# EAGLE design Frequency Counter (EAGLE 9.1.2)
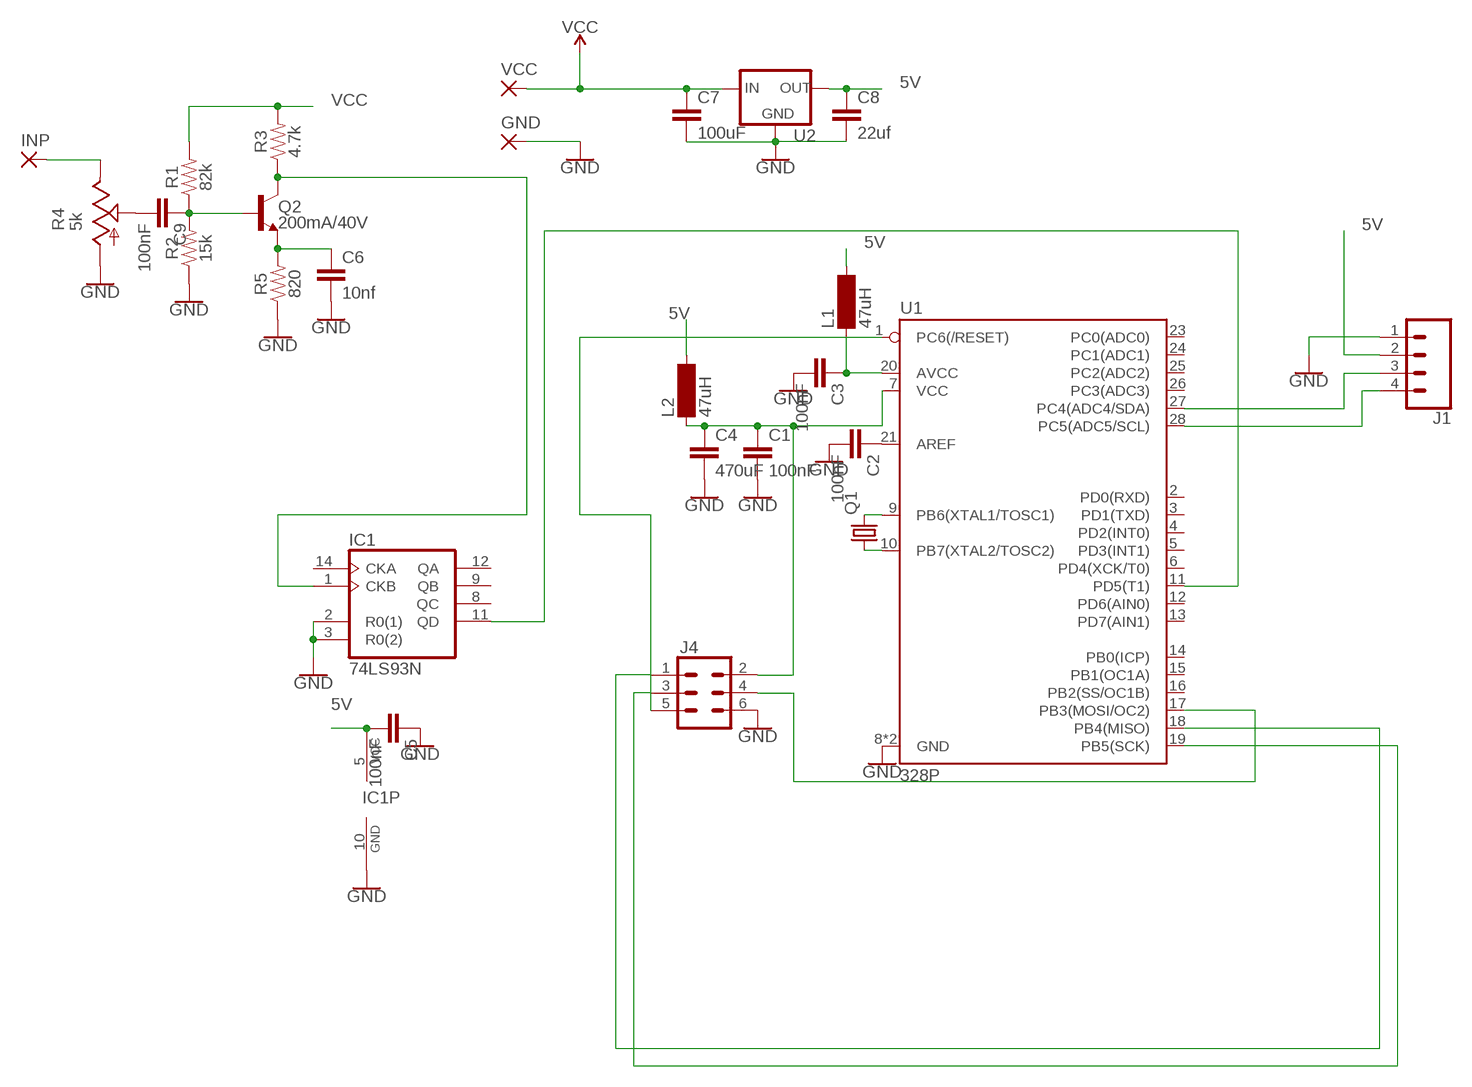
[diagram p0: schematic, sheet 1]

## Parts
C1  100nF  C5/3.5  [C5B3.5]
C2  100nF  C5/3.5  [C5B3.5]
C3  100nF  C5/3.5  [C5B3.5]
C4  470uF  C5/3.5  [C5B3.5]
C5  100nF  C5/3.5  [C5B3.5]
C6  10nf  C5/3.5  [C5B3.5]
C7  100uF  C5/3.5  [C5B3.5]
C8  22uf  C5/3.5  [C5B3.5]
C9  100nF  C5/3.5  [C5B3.5]
GND  3,17/1,1  [3,17/1,1]
IC1  74LS93N  [DIL14]
INP  2,54/1,1  [2,54/1,1]
J1  CONN_04  [1X04]
J4  CONN_03X2NO_SILK  [2X3-NS]
L1  47uH  BS75  [BS75]
L2  47uH  BS75  [BS75]
Q1  CRYTALHC49S  [HC49/S]
Q2  200mA/40V  TRANS_NPN-2N3904  [TO-92]
R1  82k  10KOHM-HORIZ-1/4W-1%  [AXIAL-0.3]
R2  15k  10KOHM-HORIZ-1/4W-1%  [AXIAL-0.3]
R3  4.7k  10KOHM-HORIZ-1/4W-1%  [AXIAL-0.3]
R4  5k  TRIM_US-B25V  [B25V]
R5  820  10KOHM-HORIZ-1/4W-1%  [AXIAL-0.3]
U1  328P  ATMEGA328P_PDIP  [DIP28]
U2  V_REG_78XXSINK  [TO220-IGO]
VCC  3,17/1,1  [3,17/1,1]

## Nets
5V: C5.2 C8.1 IC1.5(VCC) J1.2 L1.2 L2.2 U2.OUT
GND: C1.2 C2.2 C3.2 C4.2 C5.1 C6.2 C7.2 C8.2 GND.1(P) IC1.2(R0(1)) IC1.3(R0(2)) IC1.10(GND) J1.1 J4.6 R2.P$1 R4.A R5.P$1 U1.8(GND) U1.22(GND) U2.GND
N$1: C2.1 U1.21(AREF)
N$2: Q1.2 U1.9(PB6(XTAL1/TOSC1))
N$3: Q1.1 U1.10(PB7(XTAL2/TOSC2))
N$4: C1.1 C4.1 J4.2 L2.1 U1.7(VCC)
N$5: J1.3 U1.27(PC4(ADC4/SDA))
N$6: J1.4 U1.28(PC5(ADC5/SCL))
N$7: INP.1(P) R4.E
N$8: C9.1 Q2.2(B) R1.P$1 R2.P$2
N$9: C9.2 R4.S
N$11: IC1.1(CKB) Q2.3(C) R3.P$1
N$12: C6.1 Q2.1(E) R5.P$2
N$15: IC1.11(QD) U1.11(PD5(T1))
N$21: C3.1 L1.1 U1.20(AVCC)
N$22: J4.4 U1.17(PB3(MOSI/OC2))
N$23: J4.1 U1.18(PB4(MISO))
N$24: J4.3 U1.19(PB5(SCK))
N$25: J4.5 U1.1(PC6(/RESET))
VCC: C7.1 R1.P$2 R3.P$2 U2.IN VCC.1(P)
Unconnected: IC1.8(QC) IC1.9(QB) IC1.12(QA) IC1.14(CKA) U1.2(PD0(RXD)) U1.3(PD1(TXD)) U1.4(PD2(INT0)) U1.5(PD3(INT1)) U1.6(PD4(XCK/T0)) U1.12(PD6(AIN0)) U1.13(PD7(AIN1)) U1.14(PB0(ICP)) U1.15(PB1(OC1A)) U1.16(PB2(SS/OC1B)) U1.23(PC0(ADC0)) U1.24(PC1(ADC1)) U1.25(PC2(ADC2)) U1.26(PC3(ADC3))

## Library data of the parts
C1-C9 = capacitor-wima:C: CAPACITOR naming: grid - package width
GND VCC = wirepad:3,17/1,1: THROUGH-HOLE PAD
IC1 = 74xx-us:74*93: Decade, divide by twelve and binary COUNTER
INP = wirepad:2,54/1,1: THROUGH-HOLE PAD
J1 = SparkFun-Connectors:CONN_04: Multi connection point. Often used as Generic Header-pin footprint for 0.1 inch spaced/style header connections On any of the 0.1 inch spaced packages, you can populate with these: Break Away Headers - Straight <https://www.sparkfun.com/products/116> (PRT-00116) Break Away Male Headers - Right Angle <https://www.sparkfun.com/products/553> (PRT-00553) Female Headers <https://www.sparkfun.com/products/115> (PRT-00115) Break Away Headers - Machine Pin <https://www.sparkfun.com/products/117> (PRT-00117) Break Away Female Headers - Swiss Machine Pin <https://www.sparkfun.com/products/743> (PRT-00743) For SCREWTERMINALS and SPRING TERMINALS visit here: Screw Terimnals on SparkFun.com <https://www.sparkfun.com/search/results?term=Screw+Terminals> (5mm/3.5mm/2.54mm spacing) This device is also useful as a general connection point to wire up your design to another part of your project. Our various solder wires solder well into these plated through hole pads. Hook-Up Wire - Assortment (Stranded, 22 AWG) <https://www.sparkfun.com/products/11375> (PRT-11375) Hook-Up Wire - Assortment (Solid Core, 22 AWG) <https://www.sparkfun.com/products/11367> (PRT-11367) View the entire wire category on our website here <https://www.sparkfun.com/categories/141> Special notes: Molex polarized connector foot print use with SKU : PRT-08231 with associated crimp pins and housings. 1MM SMD Version SKU: PRT-10208; PROD_ID: CONN-09696
J4 = SparkFun-Connectors:CONN_03X2: Multi connection point. Often used as Generic Header-pin footprint for 0.1 inch spaced/style header connections You can populate with any combo of single row headers, but if you'd like an exact match, check these: Header - 2x3 (Male, 0.1") <https://www.sparkfun.com/products/12807> (PRT-12807) Header - 2x3 (Female, 0.1") <https://www.sparkfun.com/products/13010> (PRT-13010) 2x3 Pin Shrouded Header <https://www.sparkfun.com/products/10877> (PRT-10877) On any of the 0.1 inch spaced packages, you can populate with these: Break Away Headers - Straight <https://www.sparkfun.com/products/116> (PRT-00116) Break Away Male Headers - Right Angle <https://www.sparkfun.com/products/553> (PRT-00553) Female Headers <https://www.sparkfun.com/products/115> (PRT-00115) Break Away Headers - Machine Pin <https://www.sparkfun.com/products/117> (PRT-00117) Break Away Female Headers - Swiss Machine Pin <https://www.sparkfun.com/products/743> (PRT-00743) Special note: the shrouded connector mates well with our 3x2 ribbon cables: Ribbon Crimp Connector - 6-pin (2x3, Female) <https://www.sparkfun.com/products/10651> (PRT-10651) Ribbon Cable - 6 wire (15ft) <https://www.sparkfun.com/products/10646> (PRT-10646)
L1 L2 = inductor-neosid:BS: INDUCTOR nominal inductance, magnetically screened; OC_FARNELL: unknown; OC_NEWARK: unknown
Q1 = crystal:CRYTAL: CRYSTAL
Q2 = SparkFun-DiscreteSemi:TRANS_NPN: NPN transistor Current controlled devices typically used to amplify current or used as a switch. BC547 - COM-08928 <http://www.sparkfun.com/products/8928> (TO-92 45V 100mA) (1.Collector 2.Base 3.Emitter) 2N3904 - COM-00521 <http://www.sparkfun.com/products/521> (TO-92 40V 200mA) (1.Emitter 2.Base 3.Collector) P2N2222A - COM-12852 <http://www.sparkfun.com/products/12852> (TO-92 40V 600mA) (1.Collector 2.Base 3.Emitter); PROD_ID: TRANS-08447
R1-R3 R5 = SparkFun-Resistors:10KOHM: 10kΩ resistor A resistor is a passive two-terminal electrical component that implements electrical resistance as a circuit element. Resistors act to reduce current flow, and, at the same time, act to lower voltage levels within circuits. - Wikipedia; PROD_ID: RES-12183; VALUE: 10k
R4 = pot:TRIM_US-: POTENTIOMETER
U1 = SparkFun-IC-Microcontroller:ATMEGA328P_PDIP: Atmel 328P Through hole ATMEGA328P uC used in the Arduino 32kb flash, 1k EEPROM, 2k SRAM Datasheet <http://www.sparkfun.com/datasheets/Components/SMD/ATMega328.pdf> SparkFun Products Storefront component: AVR 28 Pin 20MHz 32K 6A/D - ATMega328P <https://www.sparkfun.com/products/9061> (COM-09061) SparkFun Simon Says - Through-Hole Soldering Kit <https://www.sparkfun.com/products/10547> (KIT-10547) SparkFun Learn to Solder - Simon Says <https://www.sparkfun.com/products/13708> (KIT-13708) SparkFun BigTime Watch Kit <https://www.sparkfun.com/products/11734> (KIT-11734) SparkFun ClockIt <https://www.sparkfun.com/products/10930> (KIT-10930) SparkFun Serial Enabled LCD Kit <https://www.sparkfun.com/products/10097> (LCD-10097) SparkFun Simon Tilts - Through Hole Soldering Kit <https://www.sparkfun.com/products/12634> (KIT-12634) SparkFun Frequency Counter Kit <https://www.sparkfun.com/products/10140> (KIT-10140) FabFM Radio Kit <https://www.sparkfun.com/products/11043> (KIT-11043) SparkFun Binary Blaster Kit <https://www.sparkfun.com/products/12037> (KIT-12037) SparkFun Metro-Gnome <https://www.sparkfun.com/products/9236> (KIT-09236) ATmega328 with Arduino Optiboot (Uno) <https://www.sparkfun.com/products/10524> (DEV-10524); PROD_ID: IC-09136
U2 = SparkFun-IC-Power:V_REG_78XX: Voltage Regulator Standard 78xx regulator. IGO (Input Ground Output). Spark Fun Electronics SKU : COM-00107

## Net classes
0 default: width 0.762 mm, drill 0.762 mm, clearance 0.508 mm

## Board
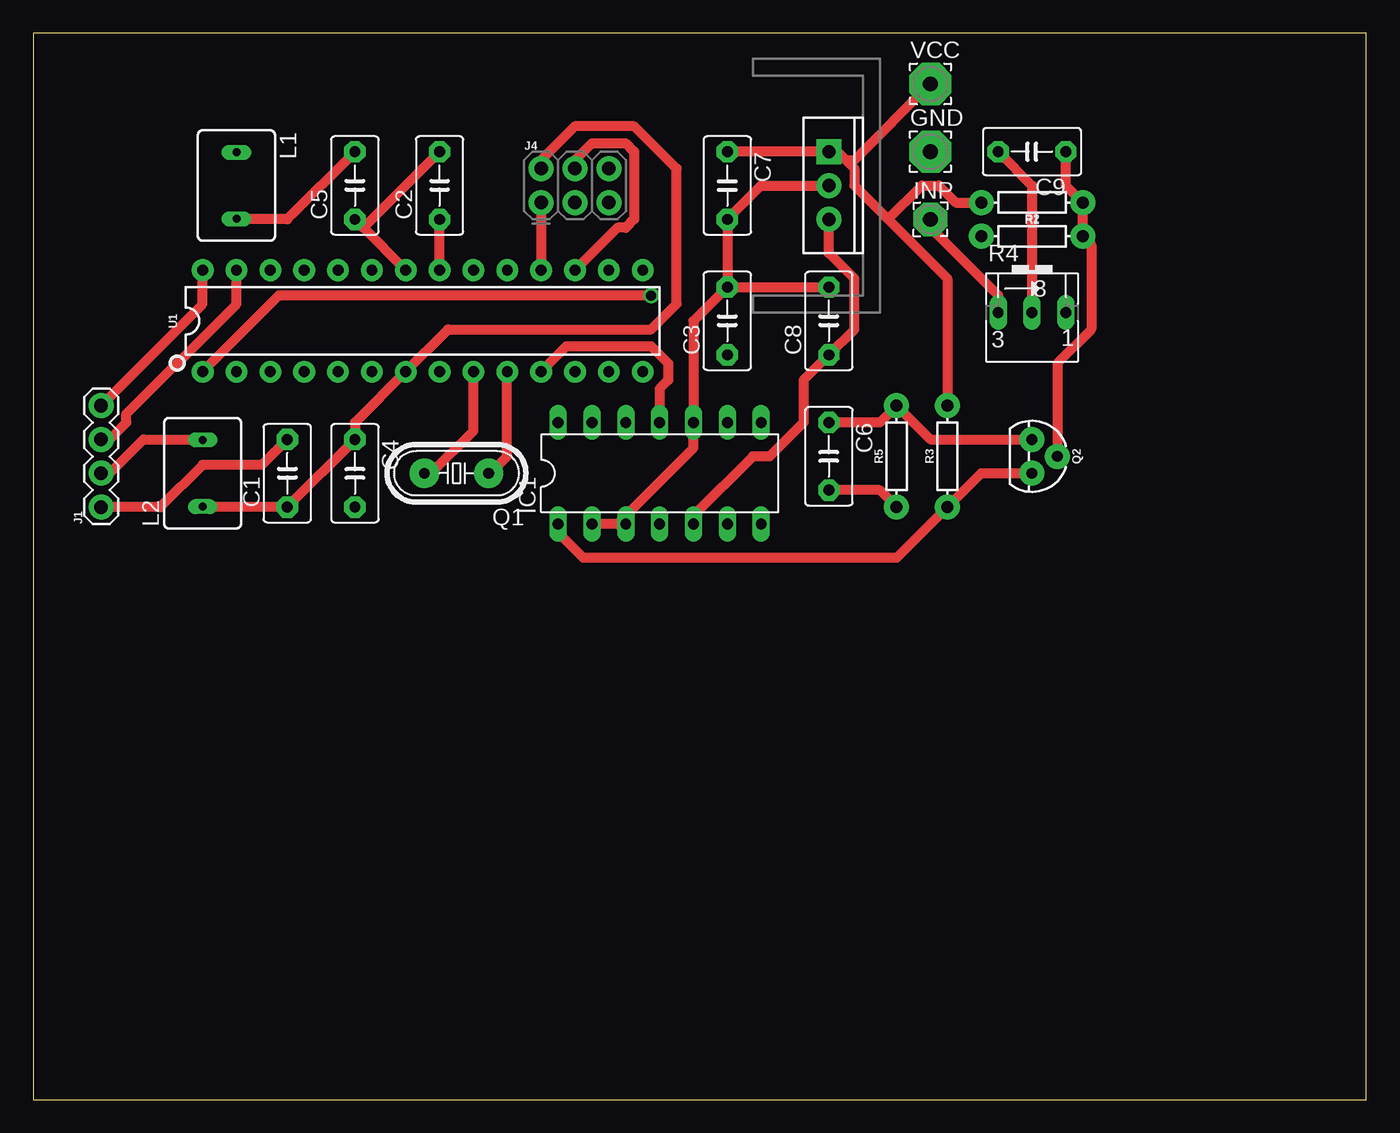
[diagram p1: board, top side]
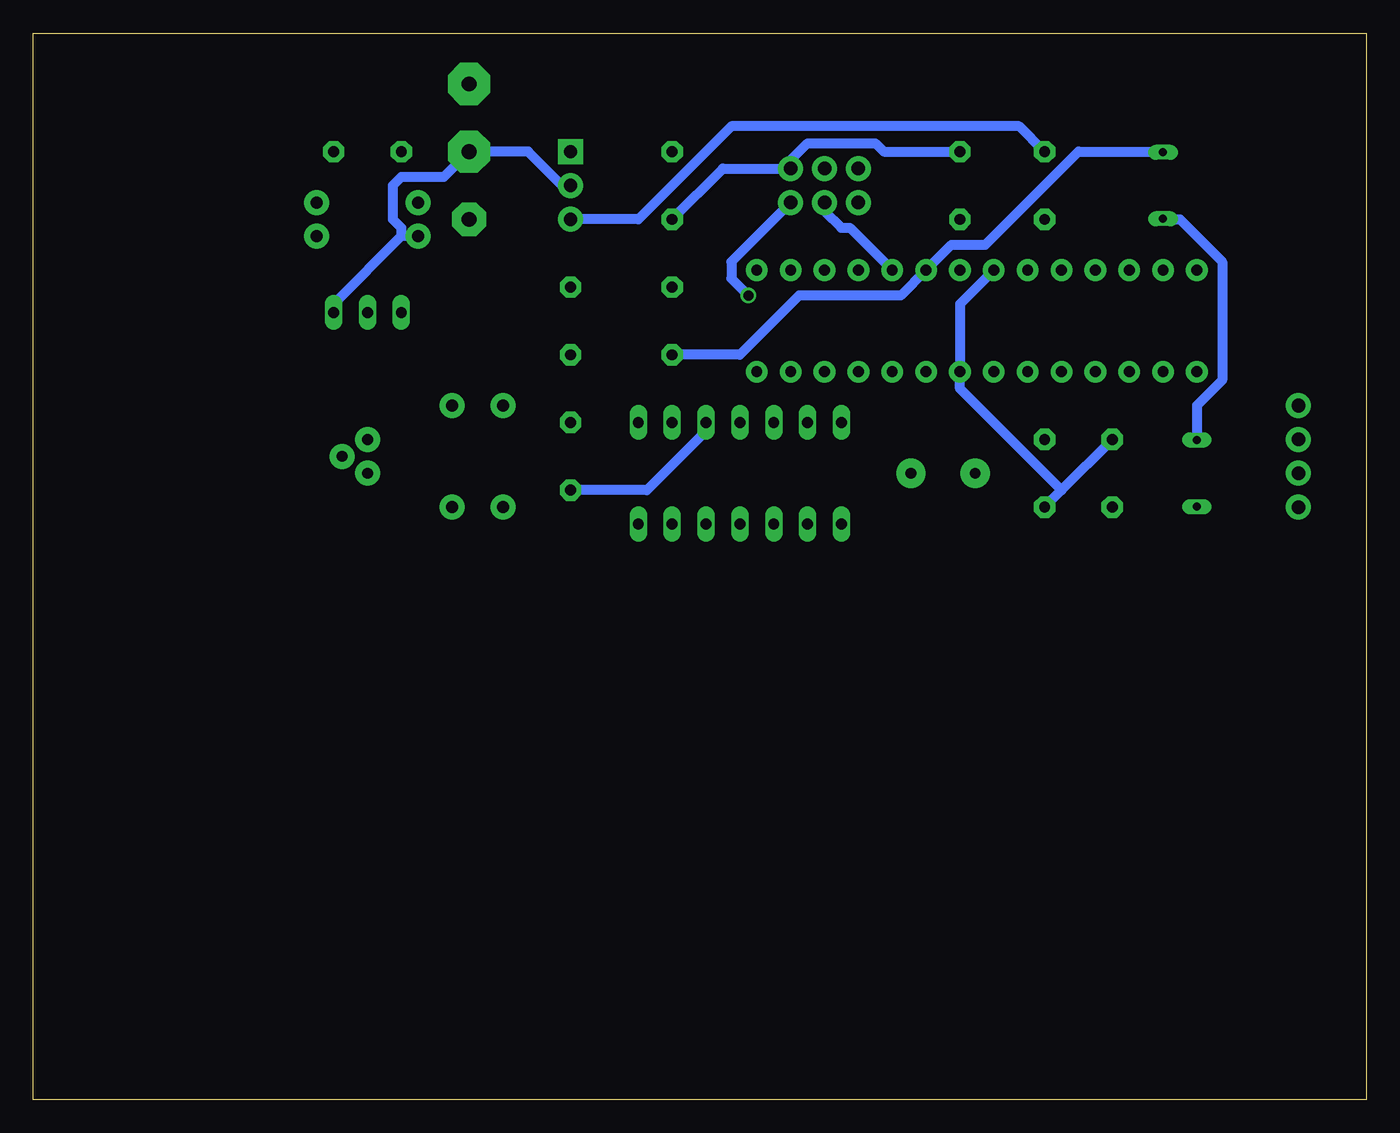
[diagram p2: board, bottom side, seen from below]

Size 100 x 80 mm. Coordinates in mm from the lower left corner, seen from the top.
Outline: 0,0 100,0 100,80 0,80 0,0
Copper layers (1*16): Top 0.035mm / dielectric 1.5mm / Bottom 0.035mm
Design rules "default": minimum track width 6mil, minimum drill 0.35mm, track to track 6mil, track to pad 6mil, pad to pad 6mil, via to via 6mil, smd to smd 6mil, copper to edge 40mil, drill to drill 6mil, minimum pad ring 10mil, minimum via ring 8mil, stop-mask expansion 4mil, vias tented up to drill 0mil, thermal gap 10mil

### Footprints (pad centres in the part's own frame; a part is rotated, then mirrored left to right if it is on the bottom)
C5B3.5 = drill 0.813 pad 1.6 octagon: 1 -2.54,0; 2 2.54,0
3,17/1,1 = drill 1.118 pad 3.175 octagon: 1 0,0
DIL14 = drill 0.813 long: 1 -7.62,-3.81; 2 -5.08,-3.81; 3 -2.54,-3.81; 4 0,-3.81; 5 2.54,-3.81; 6 5.08,-3.81; 7 7.62,-3.81; 8 7.62,3.81; 9 5.08,3.81; 10 2.54,3.81; 11 0,3.81; 12 -2.54,3.81; 13 -5.08,3.81; 14 -7.62,3.81
2,54/1,1 = drill 1.118 pad 2.54 octagon: 1 0,0
1X04 = drill 1.016 pad 1.88: 1 0,0; 2 2.54,0; 3 5.08,0; 4 7.62,0
2X3-NS = drill 1.016 pad 1.88: 1 -2.54,-1.27; 2 -2.54,1.27; 3 0,-1.27; 4 0,1.27; 5 2.54,-1.27; 6 2.54,1.27
BS75 = drill 0.6 long: 1 -2.5,0; 2 2.5,0
HC49/S = drill 0.813 pad 2.184: 1 -2.413,0; 2 2.413,0
TO-92 = drill 0.813 pad 1.88: 1 -1.27,0; 2 0,1.905; 3 1.27,0
AXIAL-0.3 = drill 0.9 pad 1.88: P$1 -3.81,0; P$2 3.81,0
B25V = drill 0.813 long: A 2.54,0.635; E -2.54,0.635; S 0,0.635
DIP28 = drill 0.813 pad 1.626: 1 -16.51,-3.81; 2 -13.97,-3.81; 3 -11.43,-3.81; 4 -8.89,-3.81; 5 -6.35,-3.81; 6 -3.81,-3.81; 7 -1.27,-3.81; 8 1.27,-3.81; 9 3.81,-3.81; 10 6.35,-3.81; 11 8.89,-3.81; 12 11.43,-3.81; 13 13.97,-3.81; 14 16.51,-3.81; 15 16.51,3.81; 16 13.97,3.81; 17 11.43,3.81; 18 8.89,3.81; 19 6.35,3.81; 20 3.81,3.81; 21 1.27,3.81; 22 -1.27,3.81; 23 -3.81,3.81; 24 -6.35,3.81; 25 -8.89,3.81; 26 -11.43,3.81; 27 -13.97,3.81; 28 -16.51,3.81
TO220-IGO = drill 1 pad 1.88: GND 0,0; OUT 2.54,0 | drill 1 pad 1.88 square: IN -2.54,0

### Placement (x,y rotation side)
C1  19.05,46.99 90 top
C2  30.48,68.58 90 top
C3  52.07,58.42 90 top
C4  24.13,46.99 270 top
C5  24.13,68.58 90 top
C6  59.69,48.26 270 top
C7  52.07,68.58 270 top
C8  59.69,58.42 90 top
C9  74.93,71.12 180 top
GND  67.31,71.12 0 top
IC1  46.99,46.99 0 top
INP  67.31,66.04 0 top
J1  5.08,44.45 90 top
J4  40.64,68.58 0 top
L1  15.24,68.58 270 top
L2  12.7,46.99 90 top
Q1  31.75,46.99 180 top
Q2  74.93,48.26 270 top
R1  74.93,67.31 180 top
R2  74.93,64.77 0 top
R3  68.58,48.26 90 top
R4  74.93,58.42 0 top
R5  64.77,48.26 90 top
U1  29.21,58.42 0 top
U2  59.69,68.58 270 top
VCC  67.31,76.2 0 top

### Tracks (layer width: path | path; a pad name or v marks a point on that pad's centre or on a via)
5V
  Top 0.762: IC1.5 49.53,43.81 53.98,48.26 55.24,48.26 57.78,50.8 57.78,53.98 C8.1 61.59,57.78 61.59,61.59 59.69,63.5 U2.OUT | J1.2 5.71,46.99 8.26,49.53 12.7,49.53 L2.2 | C5.2 19.05,66.04 15.24,66.04 L1.2
  Bottom 0.762: L2.2 12.7,49.53 12.7,52.07 10.79,53.98 10.79,62.87 13.97,66.04 15.24,66.04 L1.2 | U2.OUT 54.61,66.04 47.62,73.03 26.04,73.03 C5.2
GND
  Top 0.762: U1.22 24.77,65.41 | 24.77,65.41 C5.1 | 24.77,65.41 C2.2 | J1.1 9.53,44.45 12.7,47.62 17.14,47.62 C1.2 | C6.2 63.5,45.72 R5.P$1 | 43.81,43.18 IC1.3 43.81,43.18 | 43.81,43.18 IC1.2 | 43.81,43.18 49.53,48.9 IC1.10 49.53,58.42 C3.2 | C3.2 C7.2 54.61,68.58 U2.GND | C3.2 C8.2
  Bottom 0.762: U1.22 30.48,59.69 U1.8 30.48,53.34 22.86,45.72 | C4.2 22.86,45.72 | 22.86,45.72 C1.2 | C6.2 53.98,45.72 49.53,50.16 IC1.10 | R4.A 77.47,59.69 72.39,64.77 | R2.P$1 72.39,64.77 | 43.81,69.85 48.26,69.85 C7.2 | 43.81,69.85 J4.6 43.81,69.85 | U2.GND 60.33,68.58 62.87,71.12 GND.1 69.22,69.22 72.39,69.22 73.03,68.58 73.03,66.04 72.39,65.41 72.39,64.77 | C2.2 36.2,71.12 36.83,71.75 41.91,71.75 43.81,69.85
N$1
  Top 0.762: U1.21 C2.1
N$2
  Top 0.762: U1.9 33.02,50.16 29.84,46.99 Q1.2
N$3
  Top 0.762: U1.10 35.56,48.26 34.29,46.99 Q1.1
N$4
  Top 0.762: L2.1 12.7,44.45 C1.1 C4.1 24.13,50.8 U1.7 31.11,57.78 46.35,57.78 48.26,59.69 48.26,69.85 45.09,73.03 40.64,73.03 38.1,70.48 J4.2
N$5
  Top 0.762: U1.27 15.24,59.69 6.99,51.44 6.99,50.8 5.71,49.53 J1.3
N$6
  Top 0.762: U1.28 12.7,59.69 J1.4
N$7
  Top 0.762: R4.E 72.39,60.33 67.31,65.41 INP.1
N$8
  Top 0.762: C9.1 77.47,68.58 R1.P$1 R2.P$2 79.38,64.14 79.38,57.78 76.83,55.24 Q2.2
N$9
  Top 0.762: R4.S 74.93,68.58 C9.2
N$11
  Top 0.762: IC1.1 39.37,42.55 41.27,40.64 64.77,40.64 R3.P$1 71.12,46.99 Q2.3
N$12
  Top 0.762: C6.1 63.5,50.8 R5.P$2 67.31,49.53 Q2.1
N$15
  Top 0.762: IC1.11 46.99,53.34 47.62,53.98 47.62,55.24 46.35,56.52 40.01,56.52 U1.11
N$21
  Bottom 0.762: L1.1 15.24,71.12 21.59,71.12 28.57,64.14 31.11,64.14 U1.20 34.92,60.33 42.55,60.33 46.99,55.88 C3.1
N$22
  Top 0.762: U1.17 43.81,65.41 44.45,65.41 45.09,66.04 45.09,71.12 44.45,71.75 41.91,71.75 40.64,70.48 J4.4
N$23
  Top 0.762: J4.1 U1.18
N$24
  Bottom 0.762: U1.19 38.73,65.41 39.37,65.41 40.64,66.67 J4.3
N$25  (via drill 0.76)
  Top 0.762: U1.1 18.41,60.33 v46.35,60.33
  Bottom 0.762: v46.35,60.33 47.62,61.59 47.62,62.87 J4.5
VCC
  Top 0.762: C7.1 U2.IN 60.33,71.12 60.96,70.48 | R3.P$2 68.58,61.59 64.14,66.04 | 64.14,66.04 61.59,68.58 61.59,69.85 60.96,70.48 | R1.P$2 69.22,67.31 67.94,68.58 66.67,68.58 64.14,66.04 | VCC.1 61.59,70.48 60.96,70.48